# Altium project DARKYDEN.PrjPcb (part 14 of 14)

## Sheet CM3588.SchDoc: DARKYDEN_CONNECTEUR_1
size Letter; ApprovedBy: APPROUVÉ PAR; Author: Harold Malbrouck; Organization: Cegep Limoilou; Address1: 1300, 8e Avenue; Address2: Québec, QC; Address3: Canada; Address4: G1J 5L5; Revision: Rev.B; SheetNumber: 22; SheetTotal: 23
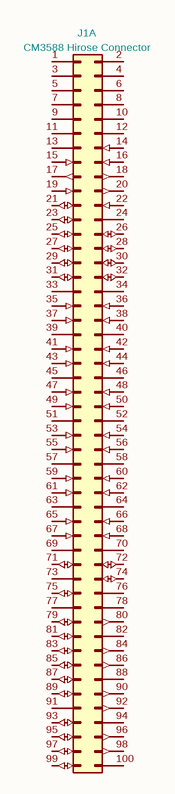
[diagram p15: CM3588.SchDoc]

### Parts
J1  CM3588 Hirose Connector  [CM3588]  (part A of 4)

### Nets

Not connected (* = marked no-connect by the designer): J1 1(VDD_DCIN) 2(VDD_DCIN) 3(VDD_DCIN) 4(VDD_DCIN) 5(VDD_DCIN) 6(VDD_DCIN) 7(VDD_DCIN) 8(VDD_DCIN) 9(VDD_DCIN) 10(VDD_DCIN) 11(GND) 12(GND) 13(GND) 14(SARADC_VIN6_HW_ID2) 15(BOOT_SARADC_IN0) 16(RESET_L) 17(PWRON_L) 18(VDC_MODE) 19(PMIC_EXT_EN_OUT) 20(UART2_TX_M0_DEBUG) 21(GPIO2_C0) 22(UART2_RX_M0_DEBUG) 23(GPIO2_C1/MIPI_CAM2_RESET_L) 24(GND) 25(GPIO2_C2/MIPI_CAM2_PDN_L) 26(GPIO4_C2) 27(GPIO2_C3) 28(GPIO4_C3) 29(GPIO2_C4) 30(GPIO4_C4) 31(GPIO4_C6) 32(GPIO4_C5) 33(GND) 34(GND) 35(MIPI_CSI1_RX_CLK1P) 36(MIPI_CSI0_RX_CLK1P) 37(MIPI_CSI1_RX_CLK1N) 38(MIPI_CSI0_RX_CLK1N) 39(GND) 40(GND) 41(MIPI_CSI1_RX_D3P) 42(MIPI_CSI0_RX_D3P) 43(MIPI_CSI1_RX_D3N) 44(MIPI_CSI0_RX_D3N) 45(GND) 46(GND) 47(MIPI_CSI1_RX_D2P) 48(MIPI_CSI0_RX_D2P) 49(MIPI_CSI1_RX_D2N) 50(MIPI_CSI0_RX_D2N) 51(GND) 52(GND) 53(MIPI_CSI1_RX_CLK0P) 54(MIPI_CSI0_RX_CLK0P) 55(MIPI_CSI1_RX_CLK0N) 56(MIPI_CSI0_RX_CLK0N) 57(GND) 58(GND) 59(MIPI_CSI1_RX_D1P) 60(MIPI_CSI0_RX_D1P) 61(MIPI_CSI1_RX_D1N) 62(MIPI_CSI0_RX_D1N) 63(GND) 64(GND) 65(MIPI_CSI1_RX_D0P) 66(MIPI_CSI0_RX_D0P) 67(MIPI_CSI1_RX_D0N) 68(MIPI_CSI0_RX_D0N) 69(GND) 70(GND) 71(GPIO1_B6) 72(LED3_25GLAN_25GLED) 73(GND) 74(LED2_25GLAN_1GLED) 75(GPIO1_B7) 76(GND) 77(GND) 78(P25G_MDIP0) 79(GPIO2_A6) 80(P25G_MDIN0) 81(GPIO2_A7) 82(GND) 83(GPIO2_B0) 84(P25G_MDIP1) 85(GPIO2_B1_GPIO,) 86(P25G_MDIN1) 87(GPIO2_B2) 88(GND) 89(GPIO2_B3) 90(P25G_MDIP2) 91(GND) 92(P25G_MDIN2) 93(GPIO2_B4) 94(GND) 95(GPIO2_B5) 96(P25G_MDIP3) 97(GPIO2_B6) 98(P25G_MDIN3) 99(GPIO2_B7) 100(GND)

### Notes on the sheet
- Titre :
- Conception :
- Date :
- Approbation :
- Heure :
- Révision :
- Feuille
- de
- Fichier :

### Library data of the parts
J1 = CM3588: LCSC: C597931; Footprint: Library:CM3588; Value: CM3588 Hirose Connector

## Nets that join several sheets
+3V3_NVME: NVME (11 pins), POWER_PCie (7 pins)
+3V3_SD_SO: SDCARD (5 pins), CONNECTEUR_4 (CON4.58)
+5V: HDMI (8 pins), NVME (C26.2 U16.1), USB2_0 (IC18.5 IC18.7 IC19.7 IC20.7)
P3V3: POWERSYSTEM (C87.2 U25.38), BATTERY_GESTION (R107.2 R118.2 R119.2), P3V3_PP5V_GESTION (C152.2 IC16.5)
PACK-: ETHERNET (8 pins), HDMI (27 pins), NVME (39 pins), POWER_PCie (18 pins), SDCARD (11 pins), CONNECTEUR_1 (26 pins), CONNECTEUR_2 (32 pins), CONNECTEUR_3 (24 pins), CONNECTEUR_4 (25 pins), POWERSYSTEM (54 pins), BATTERY_GESTION (30 pins), 12V_FROM_BATTERY (19 pins), P3V3_PP5V_GESTION (17 pins), USB2_0 (32 pins), USB2_0_Connector (28 pins)
PP5V: POWERSYSTEM (U25.34 U25.35), P3V3_PP5V_GESTION (8 pins)
VCC_SYS: POWERSYSTEM (8 pins), BATTERY_GESTION (IC13.1 R121.2), 12V_FROM_BATTERY (10 pins), P3V3_PP5V_GESTION (5 pins)
VDD33A: ETHERNET (R14.2 R15.2), HDMI (6 pins), NVME (R18.2 R22.2), USB2_0 (7 pins)
Vout: POWER_PCie (R93.1 R94.1 R98.1 R99.1), CONNECTEUR_1 (R6.2 R7.2), 12V_FROM_BATTERY (9 pins)
DN1_OUT_N: USB2_0 (BR2.4 L20.3), USB2_0_Connector (J13.5)
DN1_OUT_P: USB2_0 (BR2.2 L20.4), USB2_0_Connector (J13.4)
DN2_OUT_N: USB2_0 (BR3.4 L21.3), USB2_0_Connector (J14.5)
DN2_OUT_P: USB2_0 (BR3.2 L21.4), USB2_0_Connector (J14.4)
DN3_OUT_N: USB2_0 (BR5.4 L23.3), USB2_0_Connector (J15.2)
DN3_OUT_P: USB2_0 (BR5.2 L23.4), USB2_0_Connector (J15.3)
DN4_OUT_N: USB2_0 (BR4.4 L22.3), USB2_0_Connector (J16.2)
DN4_OUT_P: USB2_0 (BR4.2 L22.4), USB2_0_Connector (J16.3)
GPIO0_A4/SDMMC_DET_L: SDCARD (R49.1 R50.1), CONNECTEUR_4 (CON4.70)
GPIO3_B0/PWM9_M0: CONNECTEUR_4 (CON4.82), BATTERY_GESTION (IC13.6 R119.1)
GPIO3_C7/I2C5_SCL_M0_TP: CONNECTEUR_4 (CON4.81), BATTERY_GESTION (IC13.4 R107.1)
GPIO3_D0/I2C5_SDA_M0_TP: CONNECTEUR_4 (CON4.79), BATTERY_GESTION (IC13.5 R118.1)
GPIO4_B4/PCIE30X4_CLKREQn_M1_L: NVME (R20.2), CONNECTEUR_3 (CON3.65)
GPIO4_B5/PCIE30X4_WAKEn_M1_L: NVME (R21.2), CONNECTEUR_3 (CON3.67)
GPIO4_B6/PCIE30X4_PERSTn_M1_L: NVME (R19.2), CONNECTEUR_3 (CON3.69)
HDMI0_TX0_N: HDMI (L9.3), CONNECTEUR_4 (CON4.47)
HDMI0_TX0_P: HDMI (L9.4), CONNECTEUR_4 (CON4.45)
HDMI0_TX1_N: HDMI (L8.3), CONNECTEUR_4 (CON4.41)
HDMI0_TX1_P: HDMI (L8.4), CONNECTEUR_4 (CON4.39)
HDMI0_TX2_N: HDMI (L7.3), CONNECTEUR_4 (CON4.35)
HDMI0_TX2_P: HDMI (L7.4), CONNECTEUR_4 (CON4.33)
HDMI0_TX3_N: HDMI (L10.3), CONNECTEUR_4 (CON4.53)
HDMI0_TX3_P: HDMI (L10.4), CONNECTEUR_4 (CON4.51)
HDMI0_TX_ON_H: HDMI (8 pins), CONNECTEUR_4 (CON4.69)
HDMI0_TX_SBD_N: HDMI (J8.19 R54.1 U21.5 U21.6), CONNECTEUR_4 (CON4.59)
HDMI0_TX_SBD_P: HDMI (J8.14 U21.4 U21.7), CONNECTEUR_4 (CON4.57)
HDMITX0_CEC_M0: HDMI (Q3.2 R60.1), CONNECTEUR_4 (CON4.67)
HDMITX0_HPDIN_M0: HDMI (Q4.3 R51.1), CONNECTEUR_3 (CON3.95)
HDMITX0_SCL_M0: HDMI (Q1.2 R55.1), CONNECTEUR_4 (CON4.63)
HDMITX0_SDA_M0: HDMI (R57.1), CONNECTEUR_4 (CON4.65)
LED2_25GLAN_1GLED: ETHERNET (R16.1), CONNECTEUR_1 (CON1.74)
LED3_25GLAN_25GLED: ETHERNET (R17.1), CONNECTEUR_1 (CON1.72)
MDIP0_N: ETHERNET (L3.2), CONNECTEUR_1 (CON1.80)
MDIP0_P: ETHERNET (L3.1), CONNECTEUR_1 (CON1.78)
MDIP1_N: ETHERNET (L4.2), CONNECTEUR_1 (CON1.86)
MDIP1_P: ETHERNET (L4.1), CONNECTEUR_1 (CON1.84)
MDIP2_N: ETHERNET (L5.2), CONNECTEUR_1 (CON1.92)
MDIP2_P: ETHERNET (L5.1), CONNECTEUR_1 (CON1.90)
MDIP3_N: ETHERNET (L6.2), CONNECTEUR_1 (CON1.98)
MDIP3_P: ETHERNET (L6.1), CONNECTEUR_1 (CON1.96)
PCIE30_PORT0_IN_REFCLK_N: NVME (R35.2 R40.2), CONNECTEUR_3 (CON3.18)
PCIE30_PORT0_IN_REFCLK_P: NVME (R34.2 R39.2), CONNECTEUR_3 (CON3.16)
PCIE30_PORT0_RX0_N: NVME (J4.41), CONNECTEUR_3 (CON3.6)
PCIE30_PORT0_RX0_P: NVME (J4.43), CONNECTEUR_3 (CON3.4)
PCIE30_PORT0_RX1_N: NVME (J4.29), CONNECTEUR_3 (CON3.12)
PCIE30_PORT0_RX1_P: NVME (J4.31), CONNECTEUR_3 (CON3.10)
PCIE30_PORT0_TX0_N: NVME (J4.47), CONNECTEUR_3 (CON3.24)
PCIE30_PORT0_TX0_P: NVME (J4.49), CONNECTEUR_3 (CON3.22)
PCIE30_PORT0_TX1_N: NVME (J4.35), CONNECTEUR_3 (CON3.30)
PCIE30_PORT0_TX1_P: NVME (J4.37), CONNECTEUR_3 (CON3.28)
PCIE30_PORT1_IN_REFCLK_N: NVME (R33.2 R38.2), CONNECTEUR_3 (CON3.60)
PCIE30_PORT1_IN_REFCLK_P: NVME (R32.2 R37.1), CONNECTEUR_3 (CON3.58)
PCIE30_PORT1_RX2_N: NVME (J4.17), CONNECTEUR_3 (CON3.36)
PCIE30_PORT1_RX2_P: NVME (J4.19), CONNECTEUR_3 (CON3.34)
PCIE30_PORT1_RX3_N: NVME (J4.5), CONNECTEUR_3 (CON3.42)
PCIE30_PORT1_RX3_P: NVME (J4.7), CONNECTEUR_3 (CON3.40)
PCIE30_PORT1_TX2_N: NVME (J4.23), CONNECTEUR_3 (CON3.48)
PCIE30_PORT1_TX2_P: NVME (J4.25), CONNECTEUR_3 (CON3.46)
PCIE30_PORT1_TX3_N: NVME (J4.11), CONNECTEUR_3 (CON3.54)
PCIE30_PORT1_TX3_P: NVME (J4.13), CONNECTEUR_3 (CON3.52)
PMIC_EXT_EN_OUT: POWER_PCie (R95.1 R100.1), CONNECTEUR_1 (CON1.19)
PWR1: USB2_0 (BR2.1 IC18.6 IC18.8 IC19.8), USB2_0_Connector (6 pins)
PWR2: USB2_0 (BR3.1 IC19.5), USB2_0_Connector (6 pins)
PWR3: USB2_0 (BR5.1 IC20.8), USB2_0_Connector (6 pins)
PWR4: USB2_0 (BR4.1 IC20.5), USB2_0_Connector (6 pins)
SD_CLK: SDCARD (J7.5), CONNECTEUR_4 (CON4.60)
SDMMC0_CMD: SDCARD (R46.1), CONNECTEUR_4 (CON4.56)
SDMMC0_D0: SDCARD (R47.1), CONNECTEUR_4 (CON4.64)
SDMMC0_D1: SDCARD (R48.1), CONNECTEUR_4 (CON4.66)
SDMMC0_D2: SDCARD (R44.1), CONNECTEUR_4 (CON4.52)
SDMMC0_D3: SDCARD (R45.1), CONNECTEUR_4 (CON4.54)
usb_N: CONNECTEUR_4 (CON4.24), USB2_0 (BR1.4 L19.3)
usb_P: CONNECTEUR_4 (CON4.22), USB2_0 (BR1.2 L19.4)